# Altium schematic sheet charger.SchDoc
size A4
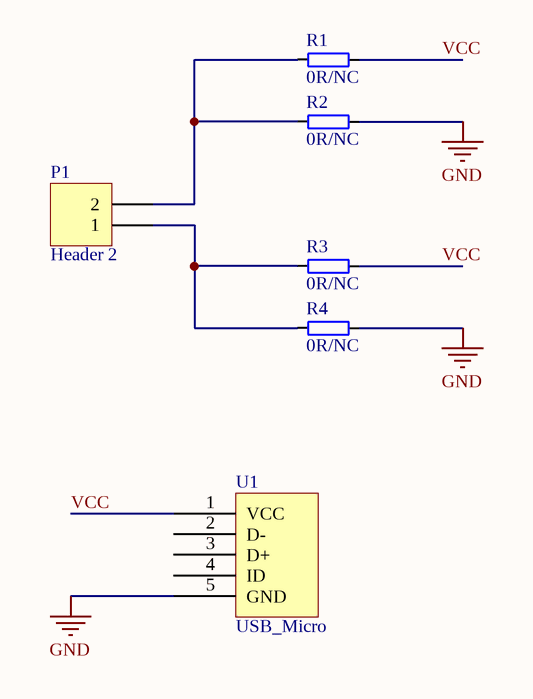
[diagram p0: charger.SchDoc]

## Parts
P1  Header 2  [USB_PIN-2]
R1  0R/NC  [0603-1]
R2  0R/NC  [0603-1]
R3  0R/NC  [0603-1]
R4  0R/NC  [0603-1]
U1  USB_Micro  [usb_micro]

## Nets
GND: R2.2 R4.2 U1.5(GND)
VCC: R1.2 R3.2 U1.1(VCC)
NetP1_1: P1.1 R3.1 R4.1
NetP1_2: P1.2 R1.1 R2.1

Not connected (* = marked no-connect by the designer): U1 2(D-) 3(D+) 4(ID)

## Library data of the parts
P1 = Header 2: Header, 2-Pin; LatestRevisionDate: 17-Jul-2002; LatestRevisionNote: Re-released for DXP Platform.; Publisher: Altium Limited
R1-R4 = R-10K: resistor